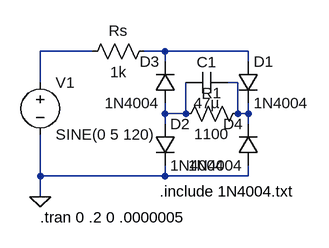
[diagram p0: schematic Lab3Pre.asc]
Lab3Pre.asc, the LTspice schematic file:
Version 4
SHEET 1 880 680
WIRE 64 64 -16 64
WIRE 176 64 144 64
WIRE 304 64 176 64
WIRE 176 80 176 64
WIRE 304 80 304 64
WIRE -16 112 -16 64
WIRE 288 112 272 112
WIRE 176 160 176 144
WIRE 208 160 208 112
WIRE 208 160 176 160
WIRE 288 160 288 112
WIRE 304 160 304 144
WIRE 304 160 288 160
WIRE 176 176 176 160
WIRE 304 176 304 160
WIRE -16 256 -16 192
WIRE 176 256 176 240
WIRE 176 256 -16 256
WIRE 304 256 304 240
WIRE 304 256 176 256
WIRE -16 288 -16 256
FLAG -16 288 0
SYMBOL diode 288 80 R0
SYMATTR InstName D1
SYMATTR Value 1N4004
SYMBOL diode 160 176 R0
SYMATTR InstName D2
SYMATTR Value 1N4004
SYMBOL diode 192 144 R180
WINDOW 0 24 64 Left 2
WINDOW 3 24 0 Left 2
SYMATTR InstName D3
SYMATTR Value 1N4004
SYMBOL diode 320 240 R180
WINDOW 0 24 64 Left 2
WINDOW 3 24 0 Left 2
SYMATTR InstName D4
SYMATTR Value 1N4004
SYMBOL cap 272 96 R90
WINDOW 0 0 32 VBottom 2
WINDOW 3 32 32 VTop 2
SYMATTR InstName C1
SYMATTR Value 47µ
SYMBOL res 304 144 R90
WINDOW 0 0 56 VBottom 2
WINDOW 3 32 56 VTop 2
SYMATTR InstName R1
SYMATTR Value 1100
SYMBOL res 160 48 R90
WINDOW 0 0 56 VBottom 2
WINDOW 3 32 56 VTop 2
SYMATTR InstName Rs
SYMATTR Value 1k
SYMBOL voltage -16 96 R0
WINDOW 123 0 0 Left 2
WINDOW 39 0 0 Left 2
SYMATTR InstName V1
SYMATTR Value SINE(0 5 120)
TEXT -16 320 Left 2 !.tran 0 .2 0 .0000005
TEXT 168 280 Left 2 !.include 1N4004.txt

The netlist it stands for:
* Lab3Pre.asc
D1 N002 N003 1N4004
D2 N004 0 1N4004
D3 N004 N002 1N4004
D4 0 N003 1N4004
C1 N003 N004 47µ
R1 N003 N004 1100
Rs N002 N001 1k
V1 N001 0 SINE(0 5 120)
.model D D
.lib standard.dio
.tran 0 .2 0 .0000005
.include 1N4004.txt
.backanno
.end